# Altium schematic sheet 08_Pressure_Sensor.SchDoc
size A
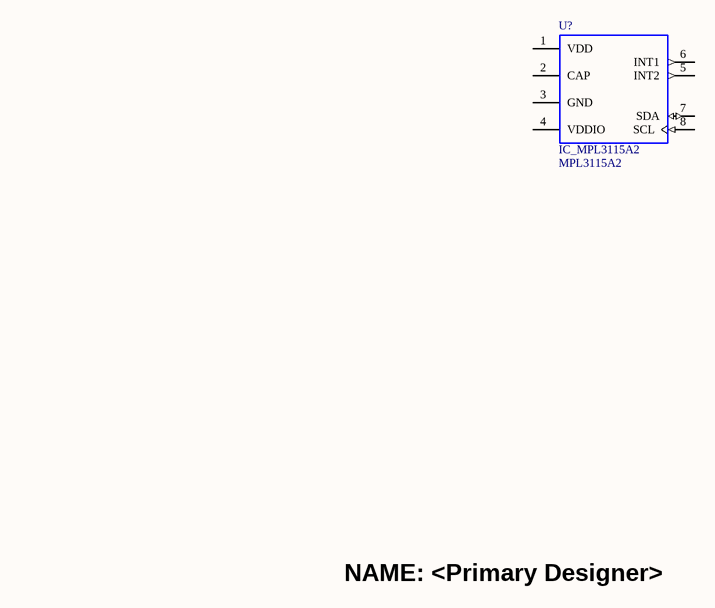
[diagram p0: 08_Pressure_Sensor.SchDoc]

## Parts
U?  IC_MPL3115A2  Manufacturer Part Number: MPL3115A2  [FRES-2153-01_V]

## Nets

Not connected (* = marked no-connect by the designer): U? 1(VDD) 2(CAP) 3(GND) 4(VDDIO) 5(INT2) 6(INT1) 7(SDA) 8(SCL)

## Notes on the sheet
- NAME: <Primary Designer>

## Library data of the parts
U? = IC_MPL3115A2: Pressure Sensor 20kPa to 110kPa Absolute 8-Pin LGA Tray; Manufacturer: NXP Freescale; Operating Supply Voltage: 2.5V; Output Type: Digital,I2C; Max Supply Voltage: 3.6V; Operating Pressure: 15.95PSI; Port Style: No Port; Max Pressure: 72.52PSI; Accuracy: 1%; Nominal Supply Current: 2uA; Min Supply Voltage: 1.95V; Max Output Voltage: 1V; Min Output Voltage: 900mV; Supplier 1: Digi-Key; Supplier Part Number 1: MPL3115A2-ND; RoHS: Yes; Stock 1: 7701; Pricing 1: 1=5.80000, 5=5.12000, 10=4.52300, 25=3.67000, 50=3.24320, 100=3.15780, 500=2.64570, 1000=2.47501, 5000=2.30432 (USD); Case/Package: LGA; Number of Pins: 8; Weight: 0.001104oz; Contact Plating: Gold; Min Operating Temperature: -40°C; Max Operating Temperature: 85°C; Package Quantity: 490; Packaging: Tray; Pressure Type: Absolute; Termination: PCB; Length: 5mm; Height: 1.2mm; Width: 3mm; Radiation Hardening: No; REACH SVHC: No SVHC; ComponentLink1URL: https://datasheet.ciiva.com/5298/mpl3115a2-39416-5298160.pdf?src-supplier=Mouser; ComponentLink1Description: https://datasheet.ciiva.com/5298/mpl3115a2-39416-5298160.pdf?src-supplier=Mouser; ComponentLink2URL: https://datasheet.ciiva.com/14666/0900766b8109ab24-14666722.pdf?src-supplier=RSComponents; ComponentLink2Description: https://datasheet.ciiva.com/14666/0900766b8109ab24-14666722.pdf?src-supplier=RSComponents; ComponentLink3URL: https://datasheet.ciiva.com/1650/1506456-1650883.pdf?src-supplier=Newark; ComponentLink3Description: https://datasheet.ciiva.com/1650/1506456-1650883.pdf?src-supplier=Newark; ComponentLink4URL: https://datasheet.ciiva.com/3272/mpl3115a2-3272740.pdf?src-supplier=Avnet; ComponentLink4Description: https://datasheet.ciiva.com/3272/mpl3115a2-3272740.pdf?src-supplier=Avnet; ComponentLink5URL: https://datasheet.ciiva.com/15222/getdatasheetpartid-567123-15222302.pdf?src-supplier=Verical; ComponentLink5Description: https://datasheet.ciiva.com/15222/getdatasheetpartid-567123-15222302.pdf?src-supplier=Verical; ComponentLink6URL: https://datasheet.ciiva.com/16463/mpl3115a2-16463821.pdf?src-supplier=Future+Electronics; ComponentLink6Description: https://datasheet.ciiva.com/16463/mpl3115a2-16463821.pdf?src-supplier=Future+Electronics; ComponentLink7URL: https://datasheet.ciiva.com/2843/mpl3115a2-2843362.pdf?src-supplier=Digi-Key; ComponentLink7Description: https://datasheet.ciiva.com/2843/mpl3115a2-2843362.pdf?src-supplier=Digi-Key; ComponentLink8URL: https://datasheet.ciiva.com/1513/1789334-1513798.pdf?src-supplier=Element14; ComponentLink8Description: https://datasheet.ciiva.com/1513/1789334-1513798.pdf?src-supplier=Element14; ComponentLink9URL: https://datasheet.ciiva.com/26023/mpl3115a2-26023222.pdf?src-supplier=Avnet+Europe; ComponentLink9Description: https://datasheet.ciiva.com/26023/mpl3115a2-26023222.pdf?src-supplier=Avnet+Europe; Category: Pressure Sensors